# EAGLE design Fan (EAGLE 9.1.3)
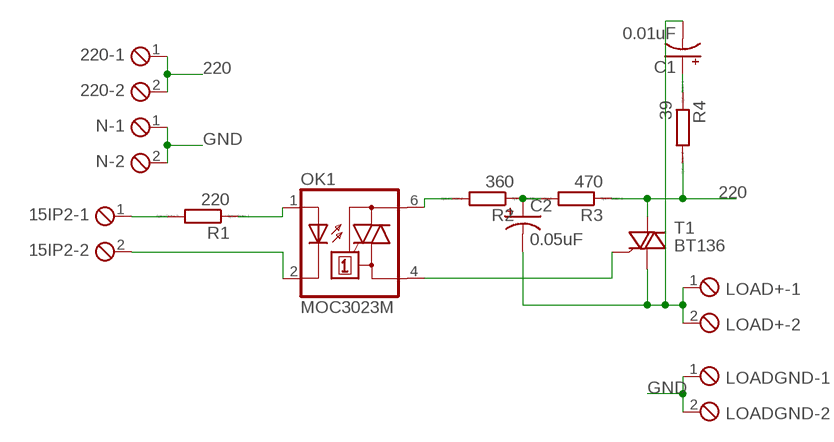
[diagram p0: schematic, sheet 1]

## Parts
15IP2  MPT2  [2POL254]
220  MPT2  [2POL254]
C1  0.01uF  1000UF-RADIAL-5MM-25V-20%  [CPOL-RADIAL-5MM-10MM]
C2  0.05uF  1000UF-RADIAL-5MM-25V-20%  [CPOL-RADIAL-5MM-10MM]
LOAD+  MPT2  [2POL254]
LOADGND  MPT2  [2POL254]
N  MPT2  [2POL254]
OK1  MOC3023M  [DIL06]
R1  220  R0204/7  [0204/7]
R2  360  R0204/7  [0204/7]
R3  470  R0204/7  [0204/7]
R4  39  R0204/7  [0204/7]
T1  BT136  [TO220AB]

## Nets
220: 220.1 220.2 R3.1 R4.2 T1.2(A2)
GND: LOADGND.1 LOADGND.2 N.1 N.2
N$1: 15IP2.1 R1.2
N$2: 15IP2.2 OK1.2(C)
N$3: OK1.1(A) R1.1
N$4: OK1.6(A2) R2.2
N$5: C2.+ R2.1 R3.2
N$6: OK1.4(A1) T1.3(G)
N$7: C1.+ R4.1
N$8: C1.- C2.- LOAD+.1 LOAD+.2 T1.1(A1)

## Library data of the parts
15IP2 220 LOAD+ LOADGND N = con-phoenix-254:MPT2: PHOENIX CONNECTOR; OC_FARNELL: unknown; OC_NEWARK: unknown
C1 C2 = SparkFun-Capacitors:1000UF: 1,000µF/1mF ceramic capacitors A capacitor is a passive two-terminal electrical component used to store electrical energy temporarily in an electric field. CAP-08070; PROD_ID: CAP-09538; VALUE: 1mF
OK1 = optocoupler:MOC30*M: RANDOM-PHASE OPTOISOLATORS TRIAC DRIVER OUTPUT Source: http://www.fairchildsemi.com MOC3020-M.pdf; MF: FAIRCHILD SEMICONDUCTOR; MPN: MOC3023-M; OC_FARNELL: 1021367; OC_NEWARK: 72K8896
R1-R4 = eagle-ltspice:R: RESISTOR, European symbol; SPICEMODEL: NONE; SPICEPREFIX: R
T1 = triac:BT136: Triac BT136 series E sensitive gate Source: http://www.nxp.com/acrobat_download/datasheets/BT136_SERIES_E_2.pdf

## Board
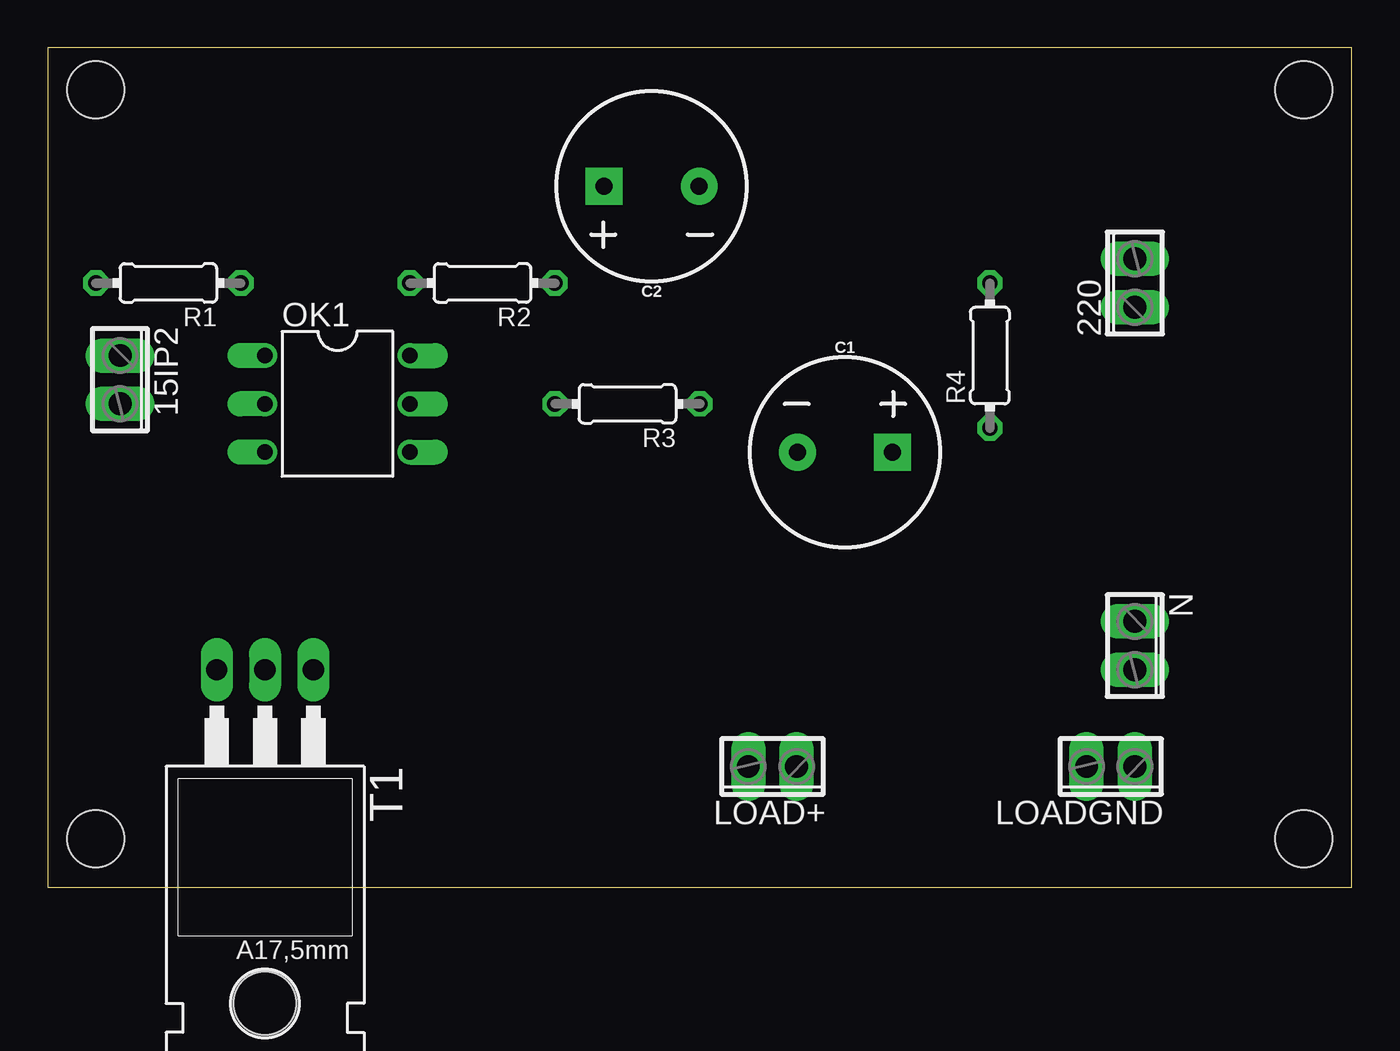
[diagram p1: board, top side]
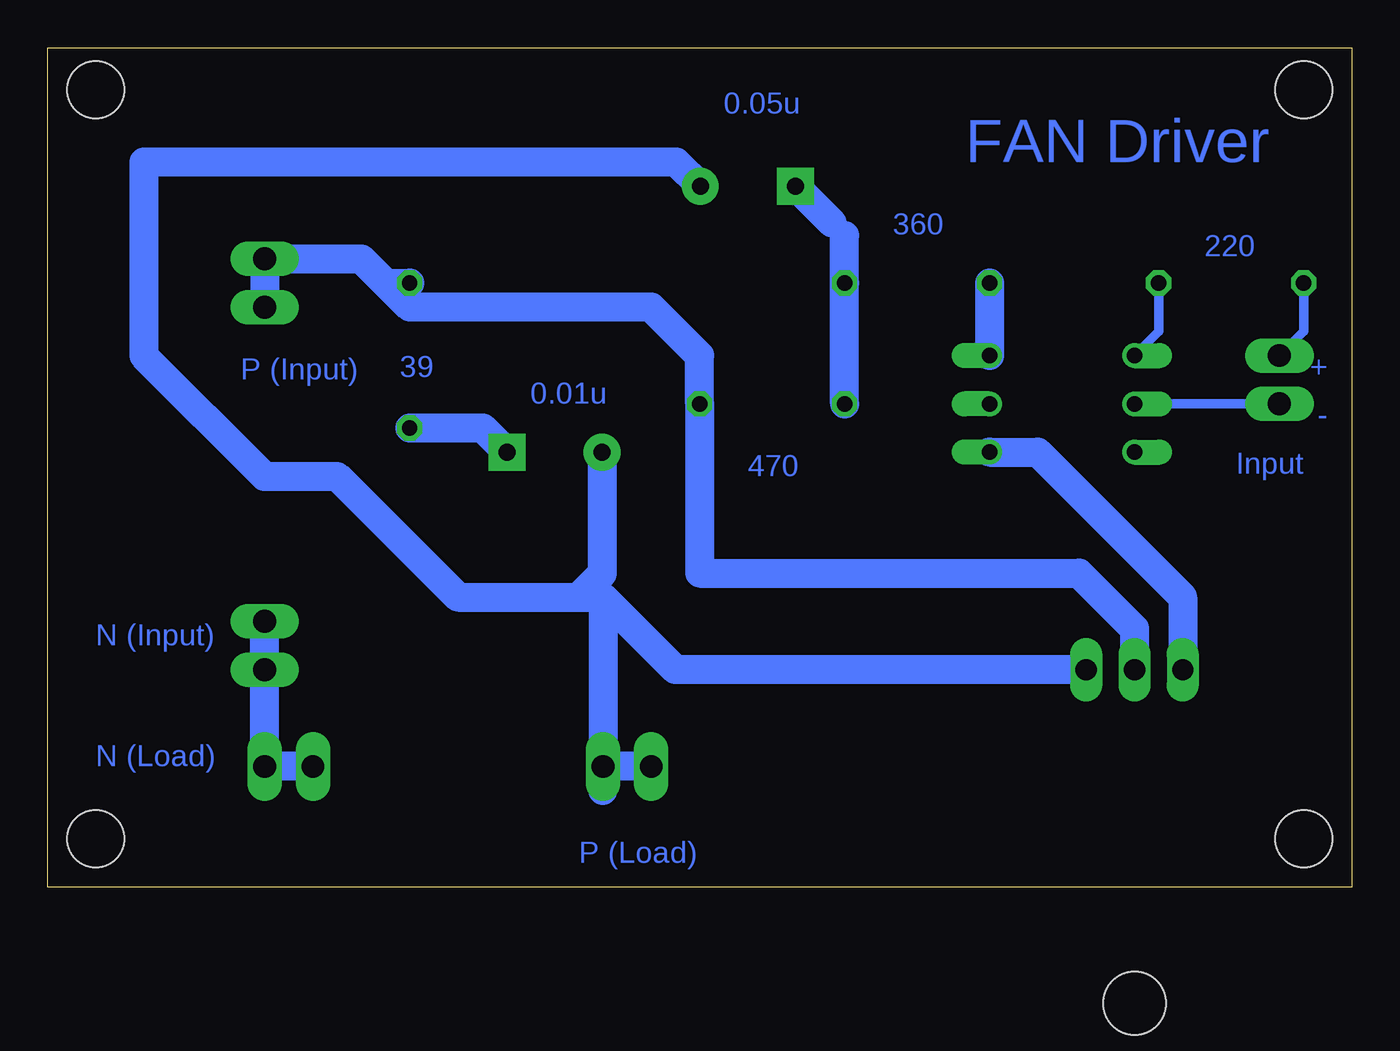
[diagram p2: board, bottom side, seen from below]

Size 68.56 x 44.12 mm. Coordinates in mm from the lower left corner, seen from the top.
Outline: 0,0 68.56,0 68.56,44.12 0,44.12 0,0
Copper layers (1*16): Top 0.035mm / dielectric 1.5mm / Bottom 0.035mm
Design rules "default": minimum track width 6mil, minimum drill 0.35mm, track to track 6mil, track to pad 6mil, pad to pad 6mil, via to via 6mil, smd to smd 6mil, copper to edge 40mil, drill to drill 6mil, minimum pad ring 10mil, minimum via ring 8mil, stop-mask expansion 4mil, vias tented up to drill 0mil, thermal gap 10mil
Holes 3 mm at 2.54,41.91 66.04,41.91 66.04,2.54 2.54,2.54

### Footprints (pad centres in the part's own frame; a part is rotated, then mirrored left to right if it is on the bottom)
2POL254 = drill 1.2 long: 1 -1.27,0; 2 1.27,0
CPOL-RADIAL-5MM-10MM = drill 0.9 pad 1.93 square: + 2.5,0 | drill 0.9 pad 1.93: - -2.5,0
DIL06 = drill 0.813 offset: 1 -2.54,-3.81; 2 0,-3.81; 3 2.54,-3.81; 4 2.54,3.81; 5 0,3.81; 6 -2.54,3.81
0204/7 = drill 0.813 octagon: 1 -3.81,0; 2 3.81,0
TO220AB = drill 1.118 long: 1 -2.54,-6.35; 2 0,-6.35; 3 2.54,-6.35 | hole 3.302: 0,11.176

### Placement (x,y rotation side)
15IP2  3.81,26.67 270 top
220  57.15,31.75 90 top
C1  41.91,22.86 0 top
C2  31.75,36.83 180 top
LOAD+  38.1,6.35 180 top
LOADGND  55.88,6.35 180 top
N  57.15,12.7 270 top
OK1  15.24,25.4 270 top
R1  360  [0204/7]  6.35,31.75 180 top
R2  22.86,31.75 180 top
R3  30.48,25.4 180 top
R4  49.53,27.94 90 top
T1  11.43,5.08 180 top

### Tracks (layer width: path | path; a pad name or v marks a point on that pad's centre or on a via)
220
  Bottom 1.524: 220.1 220.2 52.07,33.02 50.8,31.75 | 50.8,31.75 R4.2 | T1.2 11.43,13.59 14.35,16.51 34.29,16.51 R3.1 34.29,27.94 36.83,30.48 49.53,30.48 50.8,31.75
GND
  Bottom 1.524: LOADGND.2 LOADGND.1 N.2 N.1
N$1
  Bottom 0.508: 15IP2.1 2.54,29.21 R1.2
N$2
  Bottom 0.508: OK1.2 15IP2.2
N$3
  Bottom 0.508: OK1.1 10.16,29.21 R1.1
N$4
  Bottom 1.524: R2.2 OK1.6
N$5
  Bottom 0.508: 27.32,34.91 26.67,34.25
  Bottom 1.524: R3.2 R2.1 26.67,34.25 | C2.+ 27.32,34.91
N$6
  Bottom 1.524: OK1.4 16.51,22.86 8.89,15.24 T1.3
N$7
  Bottom 1.524: C1.+ 45.68,24.13 R4.1
N$8
  Bottom 0.508: C1.- 39.39,22.84 39.37,22.82 39.37,15.24
  Bottom 1.524: T1.1 35.56,11.43 39.37,15.24 | 39.37,15.24 LOAD+.1 | LOAD+.1 39.37,5.08 LOAD+.1 | LOAD+.2 LOAD+.1 | C2.- 35.52,38.1 63.5,38.1 63.5,27.94 57.15,21.59 53.34,21.59 46.99,15.24 40.64,15.24 | 40.64,15.24 39.37,15.24 | 40.64,15.24 39.39,16.49 39.39,22.84

### Text on the board
Bottom: 0.05u | FAN Driver | 220 | 360 | + | 39 | P (Input) | - | 0.01u | Input | 470 | N (Input) | N (Load) | P (Load)